# Altium project SIPROKAR_VoltageSens.PrjPcb
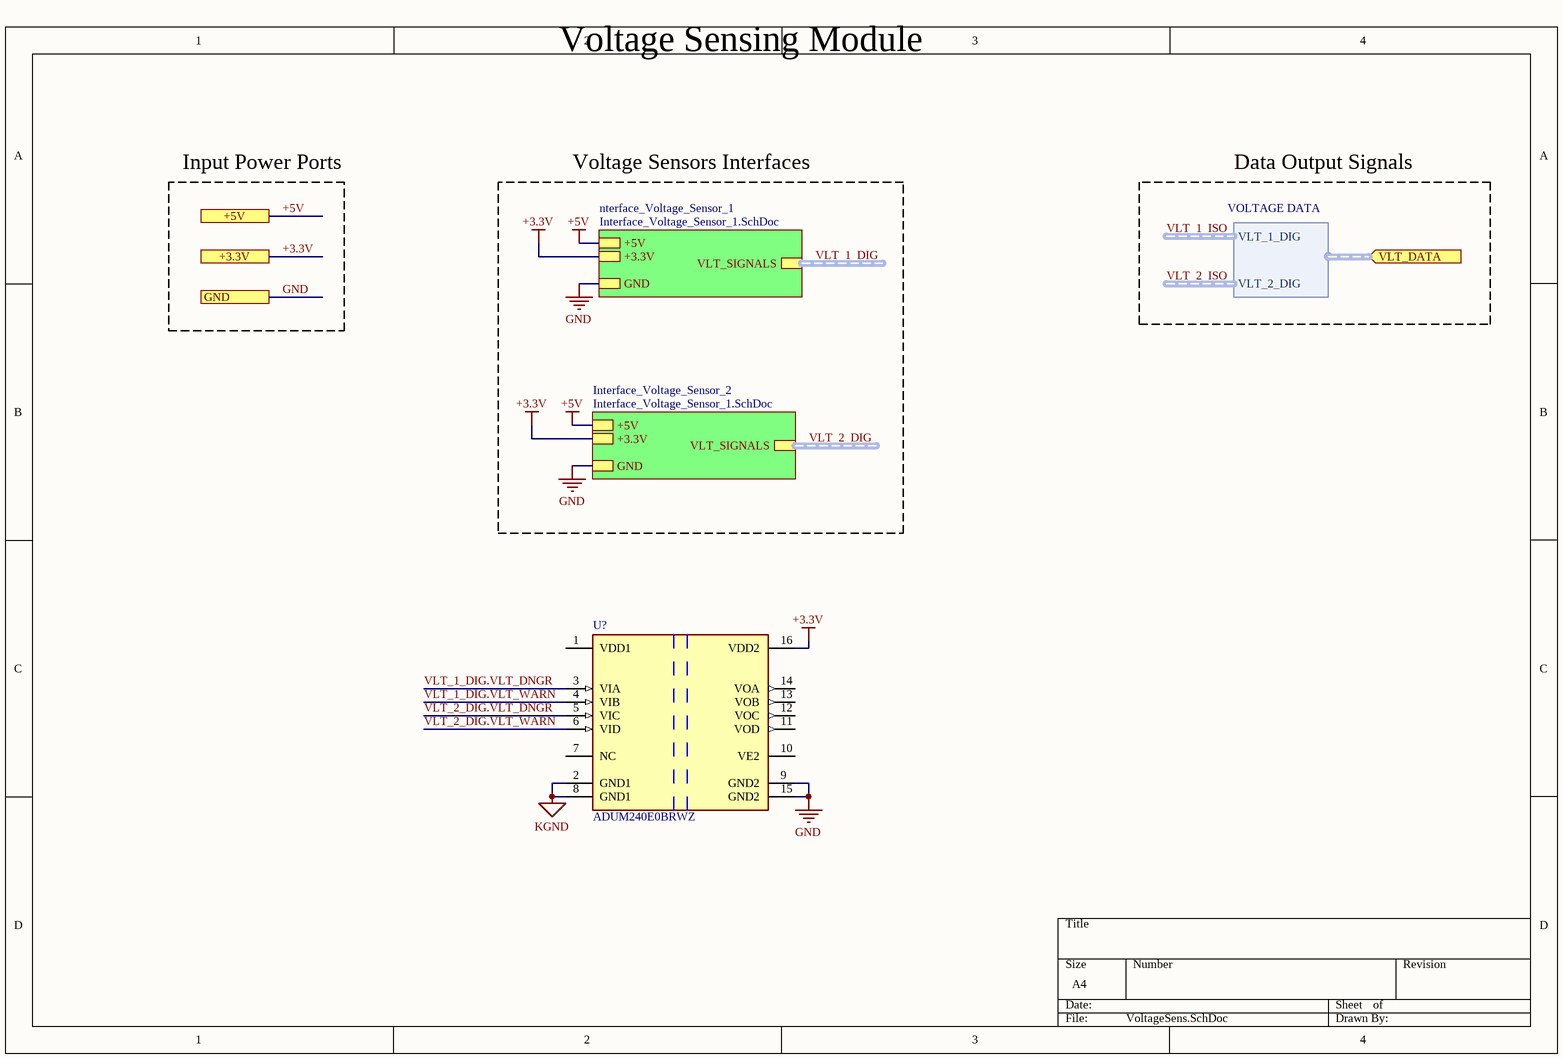
[diagram p0: VoltageSens.SchDoc]
2 sheets, 22 parts. Net scope: hierarchical (ports join the sheet entries above them; power ports are global).
Sheets:
  VoltageSens.SchDoc
  SensingVlt.SchDoc

## Sheet VoltageSens.SchDoc
size A4

### Parts
U?  ADUM240E0BRWZ  [FP-RW-16-IPC_A]

### Sub-sheets
Interface_Voltage_Sensor_2 = Interface_Voltage_Sensor_1.SchDoc (file not in this document): GND, +5V, +3.3V, VLT_SIGNALS (harness VOLTAGE SIGNALS)
nterface_Voltage_Sensor_1 = Interface_Voltage_Sensor_1.SchDoc (file not in this document): GND, +5V, +3.3V, VLT_SIGNALS (harness VOLTAGE SIGNALS)

### Ports
+3.3V, +5V, GND, VLT_DATA (in, harness VOLTAGE DATA)

### Harnesses
VOLTAGE DATA: VLT_1_DIG, VLT_2_DIG

### Nets
+3.3V: U?.16(VDD2) ; port +3.3V, sheet Interface_Voltage_Sensor_2/+3.3V, sheet nterface_Voltage_Sensor_1/+3.3V
+5V: port +5V, sheet Interface_Voltage_Sensor_2/+5V, sheet nterface_Voltage_Sensor_1/+5V
GND: U?.9(GND2) U?.15(GND2) ; port GND, sheet Interface_Voltage_Sensor_2/GND, sheet nterface_Voltage_Sensor_1/GND
KGND: U?.2(GND1) U?.8(GND1)
VLT_1_DIG.VLT_DNGR: U?.3(VIA)
VLT_1_DIG.VLT_WARN: U?.4(VIB)
VLT_2_DIG.VLT_DNGR: U?.5(VIC)
VLT_2_DIG.VLT_WARN: U?.6(VID)

Not connected (* = marked no-connect by the designer): U? 1(VDD1) 7(NC) 10(VE2) 11(VOD) 12(VOC) 13(VOB) 14(VOA)

### Buses and harness runs
harness VLT_1_DIG = sheet nterface_Voltage_Sensor_1/VLT_SIGNALS
harness VLT_2_DIG = sheet Interface_Voltage_Sensor_2/VLT_SIGNALS

### Notes on the sheet
- Voltage Sensing Module
- Input Power Ports
- Voltage Sensors Interfaces
- Data Output Signals

### Library data of the parts
U? = CMP-015-00008-1: Analog Circuit, 1 Func, CMOS, PDSO16; Min Supply Voltage: 1.7V; Time @ Peak Reflow Temperature-Max (s): 30s; Max Supply Voltage: 5.5V; Channels: 1; Package Body Material: Plastic; Nominal Supply Voltage: 1.8V; Height - Seated (Max): 2.65mm; JESD-30 Code: R-PDSO-G16; Peak Reflow Temperature (Cel): 260°C; Package Shape: Rectangular; Throw Configuration: ANALOG CIRCUIT; Technology: CMOS; RoHS Compliant: Yes; Terminal Position: DUAL; Case/Package: SOP; Terminal Form: Gull Wing; Min Operating Temperature: -40°C; Terminal Pitch: 1.27mm; Length: 10.3mm; Width: 7.5mm; Pins: 16; Surface Mount: Yes; Temperature Grade: AUTOMOTIVE; Reach SVHC Compliant: Yes; Package Style: SMALL OUTLINEMeter; Max Operating Temperature: 125°C

## Sheet SensingVlt.SchDoc
size A3; SPICEModelCachePBRVILHZ: <root> / <DocumentId>PBRVILHZ</DocumentId> / <CacheFrame Number="0"> / <Model Name="npn" Kind="MDL"> / <Text>*Default NPN BJT / *NPN Trans Pinout: C,B,E / .MODEL NPN NPN()</Text> / </Model> / </CacheFrame> / </root>
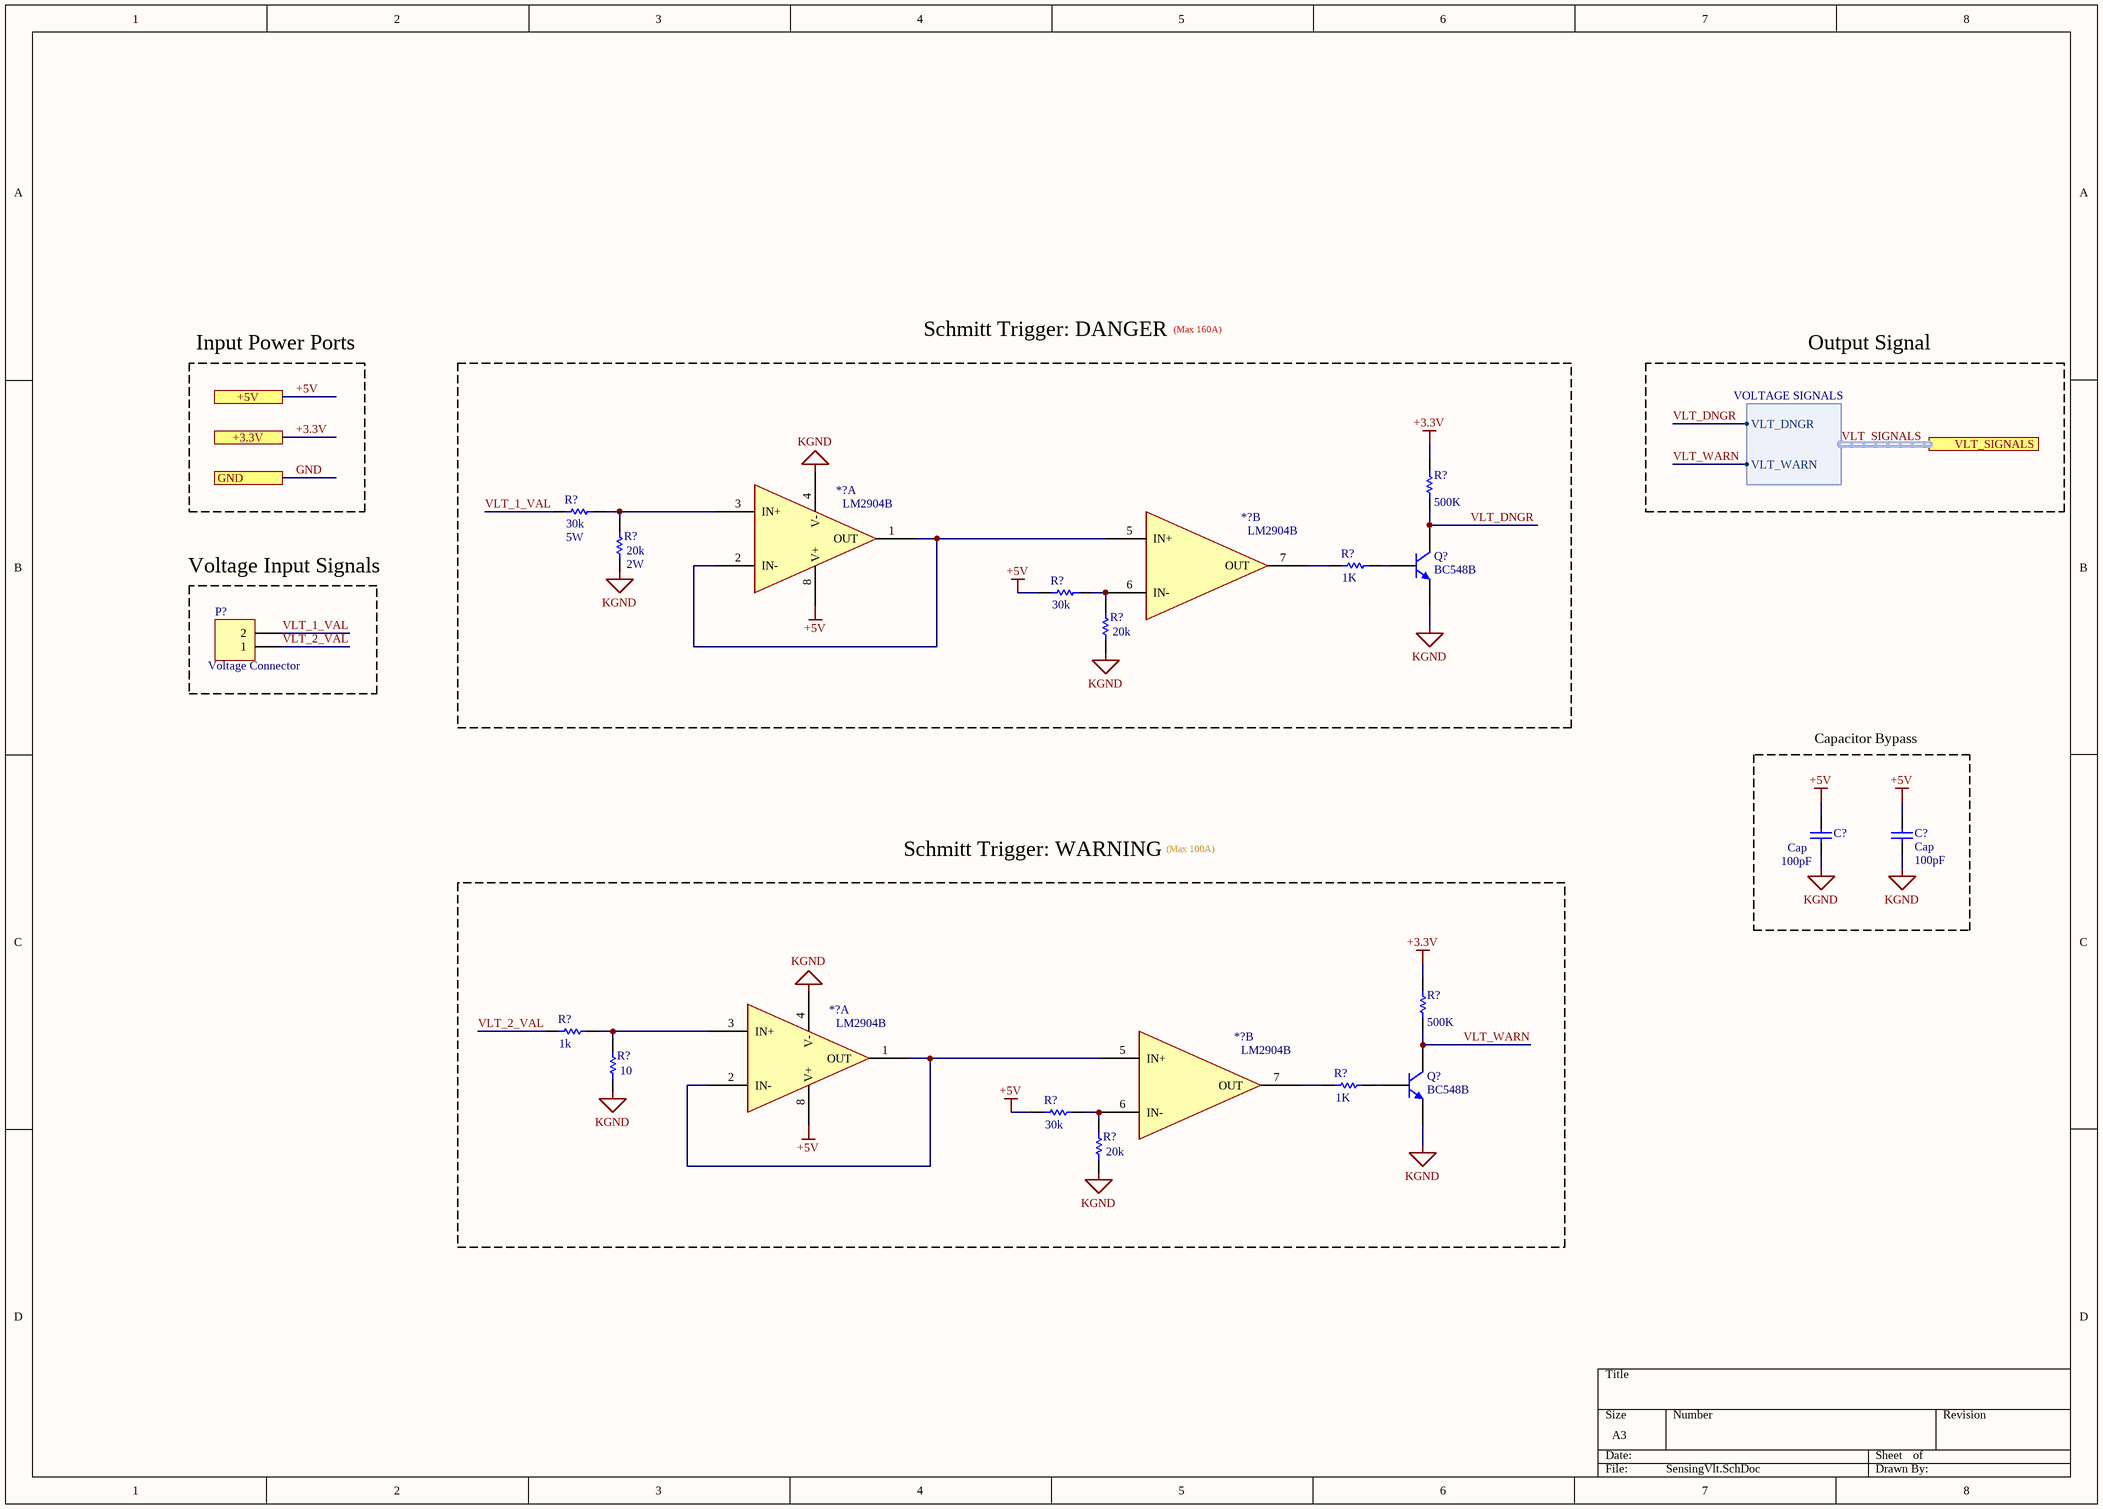
[diagram p1: SensingVlt.SchDoc]

### Parts
(Parts that share a designator on the sheet are numbered #1, #2 ... from top to bottom, then left to right.)
*?#1  LM2904B  (part A of 2)
*?#2  LM2904B  (part B of 2)
*?#3  LM2904B  (part A of 2)
*?#4  LM2904B  (part B of 2)
C?#1  Cap  value 100pF  [RAD-0.3]
C?#2  Cap  value 100pF  [RAD-0.3]
P?  Voltage Connector  [HDR1X2]
Q?#1  BC548B  [TO-226-AA]
Q?#2  BC548B  [TO-226-AA]
R?#1  5W  value 30k  [AXIAL-0.3]
R?#2  value 500K  [AXIAL-0.3]  (hidden comment: Res1)
R?#3  value 1K  [AXIAL-0.3]  (hidden comment: Res1)
R?#4  2W  value 20k  [AXIAL-0.3]
R?#5  value 30k  [AXIAL-0.3]  (hidden comment: Res1)
R?#6  value 20k  [AXIAL-0.3]  (hidden comment: Res1)
R?#7  value 1k  [AXIAL-0.3]  (hidden comment: Res1)
R?#8  value 500K  [AXIAL-0.3]  (hidden comment: Res1)
R?#9  value 1K  [AXIAL-0.3]  (hidden comment: Res1)
R?#10  value 10  [AXIAL-0.3]  (hidden comment: Res1)
R?#11  value 30k  [AXIAL-0.3]  (hidden comment: Res1)
R?#12  value 20k  [AXIAL-0.3]  (hidden comment: Res1)

### Blocks framed on the sheet
Voltage Input Signals: P?
Capacitor Bypass: C?#1 C?#2

### Ports
+3.3V, +5V, GND, VLT_SIGNALS (harness VOLTAGE SIGNALS)

### Harnesses
VOLTAGE SIGNALS: VLT_DNGR, VLT_WARN

### Nets
+3.3V: R?#2.2 R?#8.2 ; port +3.3V
+5V: *?#1.8(V+) *?#3.8(V+) C?#1.1 C?#2.1 R?#5.1 R?#11.1 ; port +5V
KGND: *?#1.4(V-) *?#3.4(V-) C?#1.2 C?#2.2 Q?#1.3(E) Q?#2.3(E) R?#4.1 R?#6.1 R?#10.1 R?#12.1
GND: port GND
VLT_1_VAL: P?.2 R?#1.1
VLT_2_VAL: P?.1 R?#7.1
VLT_DNGR: Q?#1.1(C) R?#2.1 ; port VLT_SIGNALS.VLT_DNGR
VLT_WARN: Q?#2.1(C) R?#8.1 ; port VLT_SIGNALS.VLT_WARN  [project net VLT_SIGNALS.VLT_WARN]
Net*?#1_1: *?#1.1(OUT) *?#1.2(IN-) *?#2.5(IN+)
Net*?#1_3: *?#1.3(IN+) R?#1.2 R?#4.2
Net*?#2_6: *?#2.6(IN-) R?#5.2 R?#6.2
Net*?#2_7: *?#2.7(OUT) R?#3.1
Net*?#3_1: *?#3.1(OUT) *?#3.2(IN-) *?#4.5(IN+)
Net*?#3_3: *?#3.3(IN+) R?#7.2 R?#10.2
Net*?#4_6: *?#4.6(IN-) R?#11.2 R?#12.2
Net*?#4_7: *?#4.7(OUT) R?#9.1
NetQ?#1_2: Q?#1.2(B) R?#3.2
NetQ?#2_2: Q?#2.2(B) R?#9.2

### Buses and harness runs
harness VLT_SIGNALS = port VLT_SIGNALS

### Notes on the sheet
- Input Power Ports
- Schmitt Trigger: DANGER
- (Max 160A)
- Output Signal
- Schmitt Trigger: WARNING
- (Max 100A)

### Library data of the parts
C?#1 C?#2 = Cap: Capacitor; Published: 8-Jun-2000; LatestRevisionDate: 17-Jul-2002; LatestRevisionNote: Re-released for DXP Platform.; PackageReference: RAD-0.3; Publisher: Altium Limited; PackageDescription: Radial Cap, Thru-Hole; 2 Leads; 0.3 in Pin Spacing
P? = CMP-002-00141-1: Header, 2-Pin; Component Type: Standard; Source: Miscellaneous Connectors.SchLib; LatestRevisionDate: 17-Jul-2002; LatestRevisionNote: Re-released for DXP Platform.; Signal Integrity: Connector; Publisher: Altium Limited; Pins: 2; Design Item ID: Header 2
Q?#1 Q?#2 = NPN: NPN Bipolar Transistor; Published: 8-Jun-2000; LatestRevisionDate: 17-Jul-2002; LatestRevisionNote: Re-released for DXP Platform.; PackageReference: TO-226-AA; Publisher: Altium Limited; PackageDescription: TO, Flat Index; 3 In-Line, Axial Leads; Body Dia. 4.8mm; Leads 0.55 x 0.51 mm (max); Code_JEDEC: TO-226-AA
R?#1-R?#12 = Res1: Resistor; Published: 8-Jun-2000; LatestRevisionDate: 17-Jul-2002; LatestRevisionNote: Re-released for DXP Platform.; PackageReference: AXIAL-0.3; Publisher: Altium Limited; PackageDescription: Axial Device, Thru-Hole; 2 Leads; 0.3 in Pin Spacing

## Nets that join several sheets
+3.3V: VoltageSens (U?.16), SensingVlt (R?#2.2 R?#8.2)
KGND: VoltageSens (U?.2 U?.8), SensingVlt (10 pins)